# Altium schematic sheet Sheet1.SchDoc
size A4
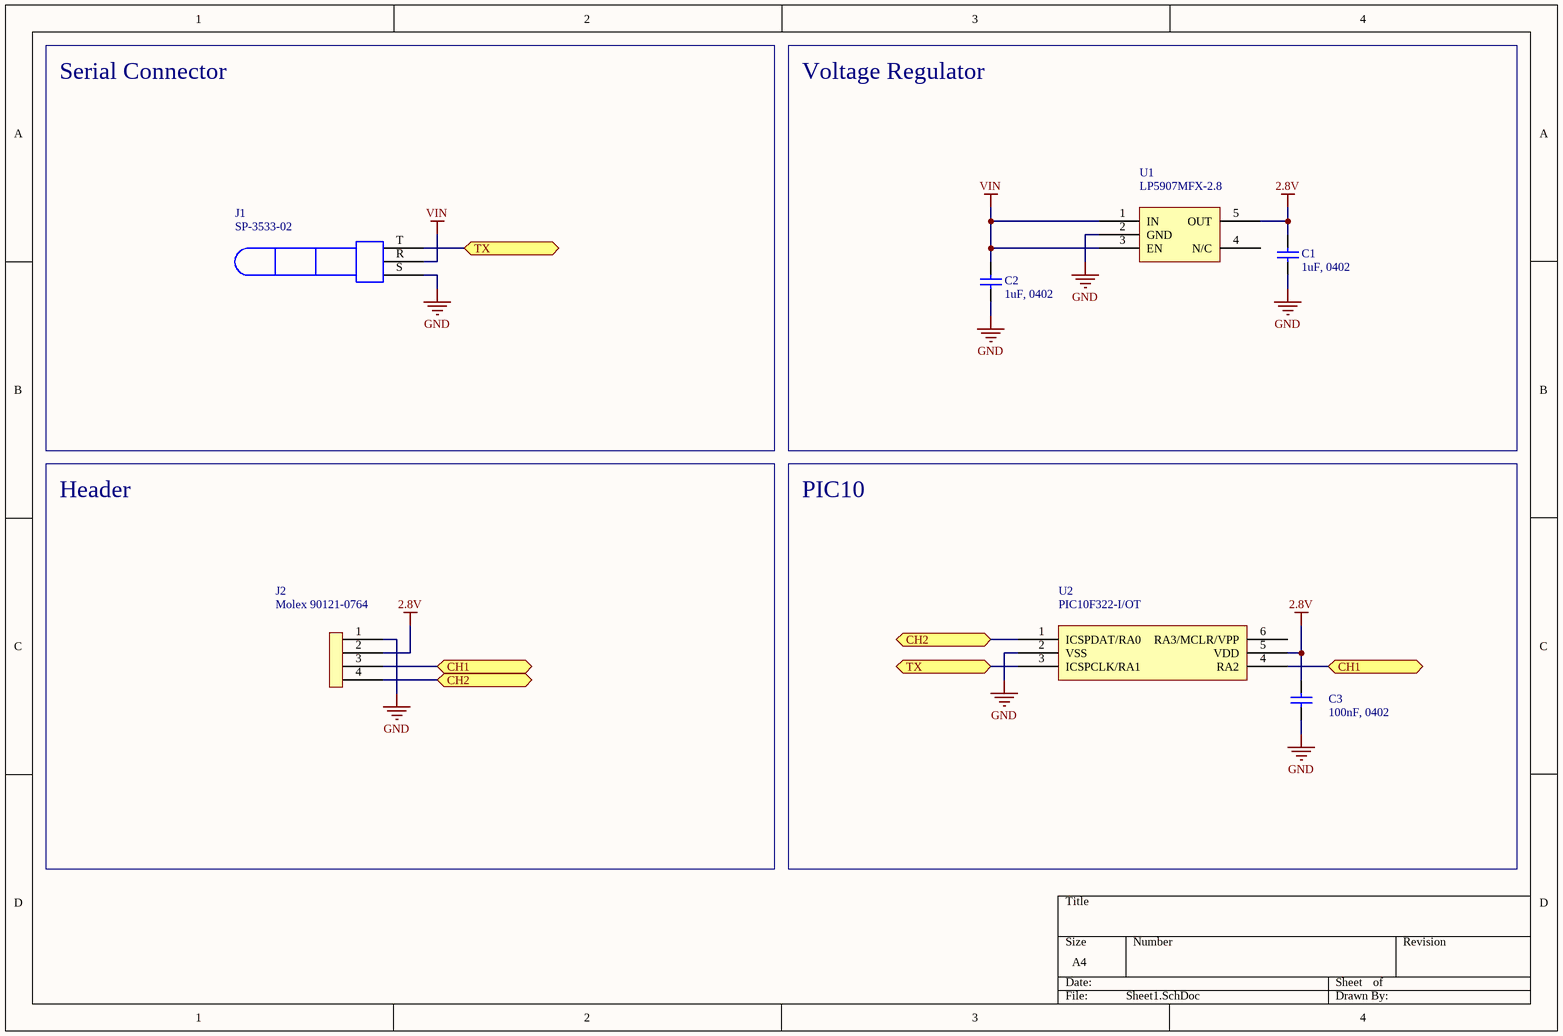
[diagram p0: Sheet1.SchDoc]

## Parts
C1  1uF, 0402  [Capacitor 0402]
C2  1uF, 0402  [Capacitor 0402]
C3  100nF, 0402  [Capacitor 0402]
J1  SP-3533-02  [SP-3533-02]
J2  Molex 90121-0764  [Molex 90121-0764]
U1  LP5907MFX-2.8  [SOT-23-5]
U2  PIC10F322-I/OT  [SOT-23-6]

## Blocks framed on the sheet
Serial Connector: J1
Voltage Regulator: C1 C2 U1
Header: J2
PIC10: C3 U2

## Ports
CH1, CH2, TX

## Nets
2.8V: C1.2 C3.2 J2.2 U1.5(OUT) U2.5(VDD)
GND: C1.1 C2.1 C3.1 J1.S J2.1 U1.2(GND) U2.2(VSS)
VIN: C2.2 J1.R U1.1(IN) U1.3(EN)
CH1: J2.3 U2.4(RA2) ; port CH1
CH2: J2.4 U2.1(ICSPDAT/RA0) ; port CH2
TX: J1.T U2.3(ICSPCLK/RA1) ; port TX

Not connected (* = marked no-connect by the designer): U1 4(N/C); U2 6(RA3/MCLR/VPP)

## Library data of the parts
C1-C3 = Capacitor
U1 = LP5907MFX-X.X